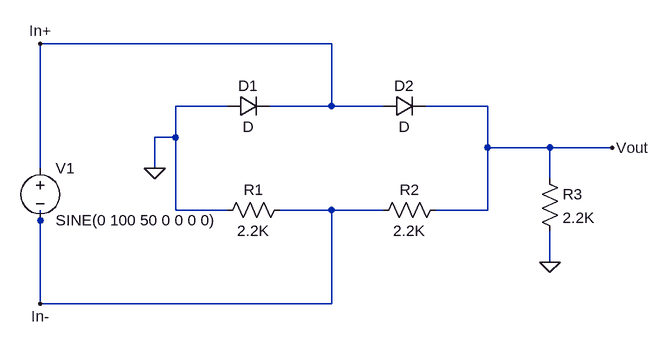
[diagram p0: schematic Diode Application (LTSpice).asc]
Diode Application (LTSpice).asc, the LTspice schematic file:
Version 4.1
SHEET 1 880 680
WIRE -128 -32 -576 -32
WIRE -288 64 -368 64
WIRE -128 64 -128 -32
WIRE -128 64 -224 64
WIRE -48 64 -128 64
WIRE 112 64 16 64
WIRE -368 112 -368 64
WIRE -368 112 -400 112
WIRE 112 128 112 64
WIRE 208 128 112 128
WIRE 304 128 208 128
WIRE -576 160 -576 -32
WIRE -400 160 -400 112
WIRE 208 176 208 128
WIRE -368 224 -368 112
WIRE -288 224 -368 224
WIRE -128 224 -208 224
WIRE -48 224 -128 224
WIRE 112 224 112 128
WIRE 112 224 32 224
WIRE -576 240 -576 224
WIRE 208 304 208 256
WIRE -576 368 -576 240
WIRE -128 368 -128 224
WIRE -128 368 -576 368
FLAG -400 160 0
FLAG 208 304 0
FLAG 304 128 Vout
FLAG -576 -32 In+
FLAG -576 368 In-
SYMBOL voltage -576 144 R0
SYMATTR InstName V1
SYMATTR Value SINE(0 100 50 0 0 0 0)
SYMBOL diode -288 80 R270
WINDOW 0 32 32 VTop 2
WINDOW 3 0 32 VBottom 2
SYMATTR InstName D1
SYMBOL diode -48 80 R270
WINDOW 0 32 32 VTop 2
WINDOW 3 0 32 VBottom 2
SYMATTR InstName D2
SYMBOL res -192 208 R90
WINDOW 0 0 56 VBottom 2
WINDOW 3 32 56 VTop 2
SYMATTR InstName R1
SYMATTR Value 2.2K
SYMBOL res 48 208 R90
WINDOW 0 0 56 VBottom 2
WINDOW 3 32 56 VTop 2
SYMATTR InstName R2
SYMATTR Value 2.2K
SYMBOL res 192 160 R0
SYMATTR InstName R3
SYMATTR Value 2.2K

The netlist it stands for:
* Diode Application (LTSpice).asc
V1 In+ In- SINE(0 100 50 0 0 0 0)
D1 0 In+ D
D2 In+ Vout D
R1 In- 0 2.2K
R2 Vout In- 2.2K
R3 Vout 0 2.2K
.model D D
.lib standard.dio
.backanno
.end